# EAGLE schematic hx711-RJ12-board (EAGLE 8.7.1)
DELETE: MF
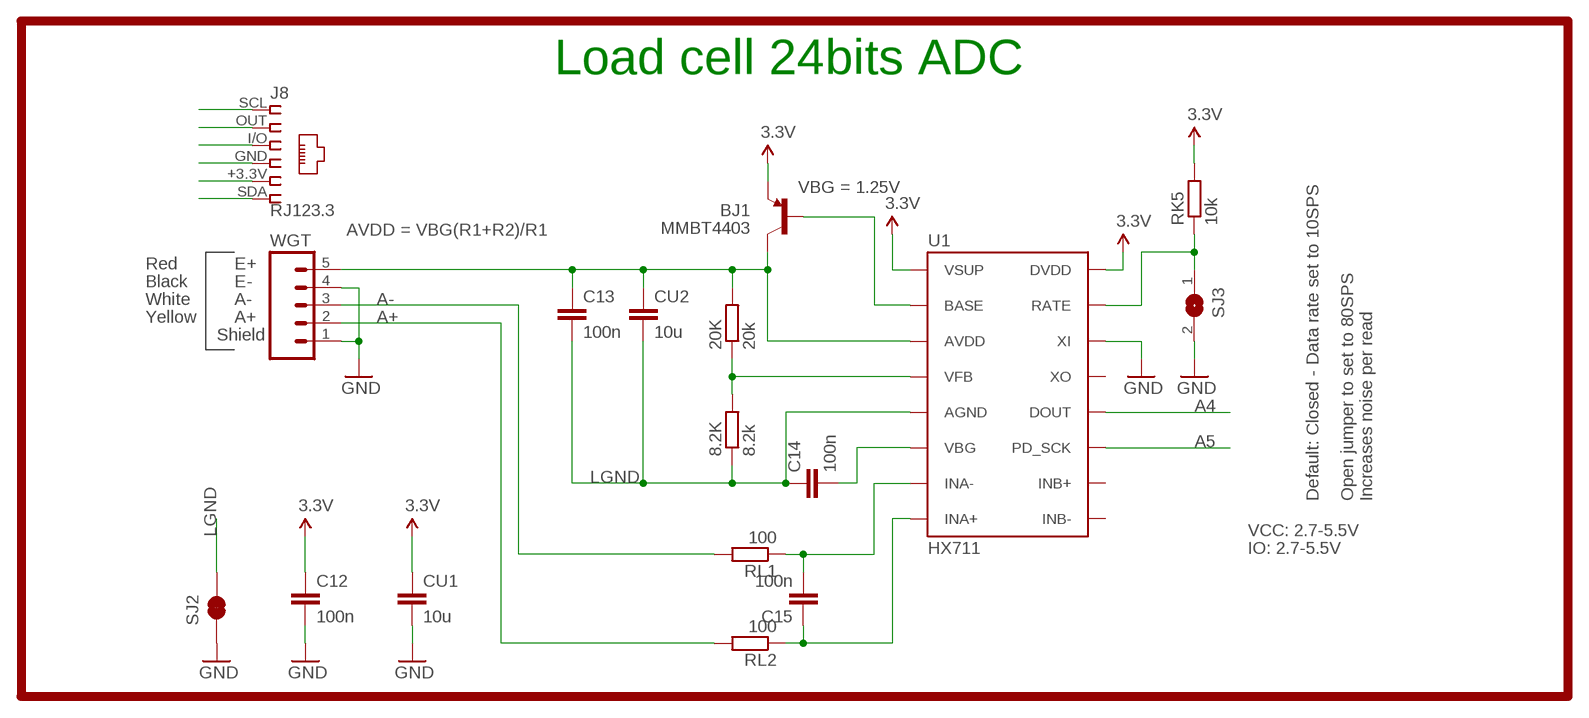
[diagram p0: schematic, sheet 1]

## Parts
8.2K  8.2k  R-EU_M0805  [M0805]
20K  20k  R-EU_M0805  [M0805]
BJ1  MMBT4403  TRANSISTOR_PNPMMBT4403  [SOT23-3]
C12  100n  C-EUC0805  [C0805]
C13  100n  C-EUC0805  [C0805]
C14  100n  C-EUC0805  [C0805]
C15  100n  C-EUC0805  [C0805]
CU1  10u  C-EUC0805  [C0805]
CU2  10u  C-EUC0805  [C0805]
J8  RJ123.3  [RJ12-STRAIGHT-3.3]
RK5  10k  R-EU_M0805  [M0805]
RL1  100  R-EU_M0805  [M0805]
RL2  100  R-EU_M0805  [M0805]
SJ2  JUMPER-PAD-2-NC_BY_TRACE  [PAD-JUMPER-2-NC_BY_TRACE_YES_SILK]
SJ3  SJ  [SJ]
U1  HX711  HX711HX711  [SO16]
WGT  M05PTH  [1X05]

## Nets
3.3V [power]: BJ1.2(E) C12.1 CU1.1 RK5.2 U1.1(VSUP) U1.16(DVDD)
A4: U1.12(DOUT)
A5: U1.11(PD_SCK)
A+: RL2.2 WGT.2
A-: RL1.2 WGT.3
CN3: C14.2 U1.6(VBG)
GND [power]: C12.2 CU1.2 SJ2.1 SJ3.2 U1.14(XI) WGT.1 WGT.4
LGND: 8.2K.1 C13.2 C14.1 CU2.2 SJ2.2 U1.5(AGND)
N$2: 20K.2 BJ1.3(C) C13.1 CU2.1 U1.3(AVDD) WGT.5
N$20: C15.2 RL1.1 U1.7(INA-)
N$27: J8.SCL
N$28: J8.OUT
N$29: J8.I/O
N$30: J8.GND
N$31: J8.+3.3V
N$32: J8.SDA
N$38: BJ1.1(B) U1.2(BASE)
N$39: 8.2K.2 20K.1 U1.4(VFB)
N$41: RK5.1 SJ3.1 U1.15(RATE)
N$43: C15.1 RL2.1 U1.8(INA+)
Unconnected: U1.9(INB-) U1.10(INB+) U1.13(XO)

## Notes on the sheet
- Load cell 24bits ADC
- VBG = 1.25V
- AVDD = VBG(R1+R2)/R1
- Red | E+
- Black | E-
- White | A-
- Yellow | A+
- Shield
- Default: Closed - Data rate set to 10SPS
- Open jumper to set to 80SPS
  Increases noise per read
- VCC: 2.7-5.5V
- IO: 2.7-5.5V

## Library data of the parts
8.2K 20K RK5 RL1 RL2 = resistor:R-EU_: RESISTOR, European symbol
BJ1 = SparkFun-DiscreteSemi:TRANSISTOR_PNP: Generic PNP BJT Double check pinouts against datasheets- not all devices are the same! MMBT3906 - 40V 200mA SOT-23 (TRANS-08052) MMBT4403 - 40V 600mA SOT-23 (TRANS-09245); PROD_ID: TRANS-09245
C12-C15 CU1 CU2 = rcl:C-EU: CAPACITOR, European symbol
J8 = lpatiny:RJ12: CORCOM Modular RJ Jacks No Shield Source: www.tycoelectronics.com .. ENG_DS_1654001_1099_RJ_L_0507.pdf
SJ2 = SparkFun-Passives:JUMPER-PAD-2-NC_BY_TRACE
SJ3 = jumper:SJ: SMD solder JUMPER
U1 = Testing:HX711; PROD_ID: IC-12445
WGT = SparkFun-Connectors:M05: Header 5 Standard 5-pin 0.1" header. Use with straight break away headers (SKU : PRT-00116), right angle break away headers (PRT-00553), swiss pins (PRT-00743), machine pins (PRT-00117), and female headers (PRT-00115). Molex polarized connector foot print use with SKU : PRT-08230 with associated crimp pins and housings.

## Net classes
0 default: width 0.406 mm, clearance 0.25 mm
1 power: width 0.406 mm, drill 0.305 mm, clearance 0.25 mm
2 VIN: width 0.406 mm, clearance 0.25 mm
3 fine: width 0.406 mm, clearance 0.25 mm
4 aref: width 0.406 mm, clearance 0.25 mm